# Altium schematic sheet Charger.SchDoc
size A3
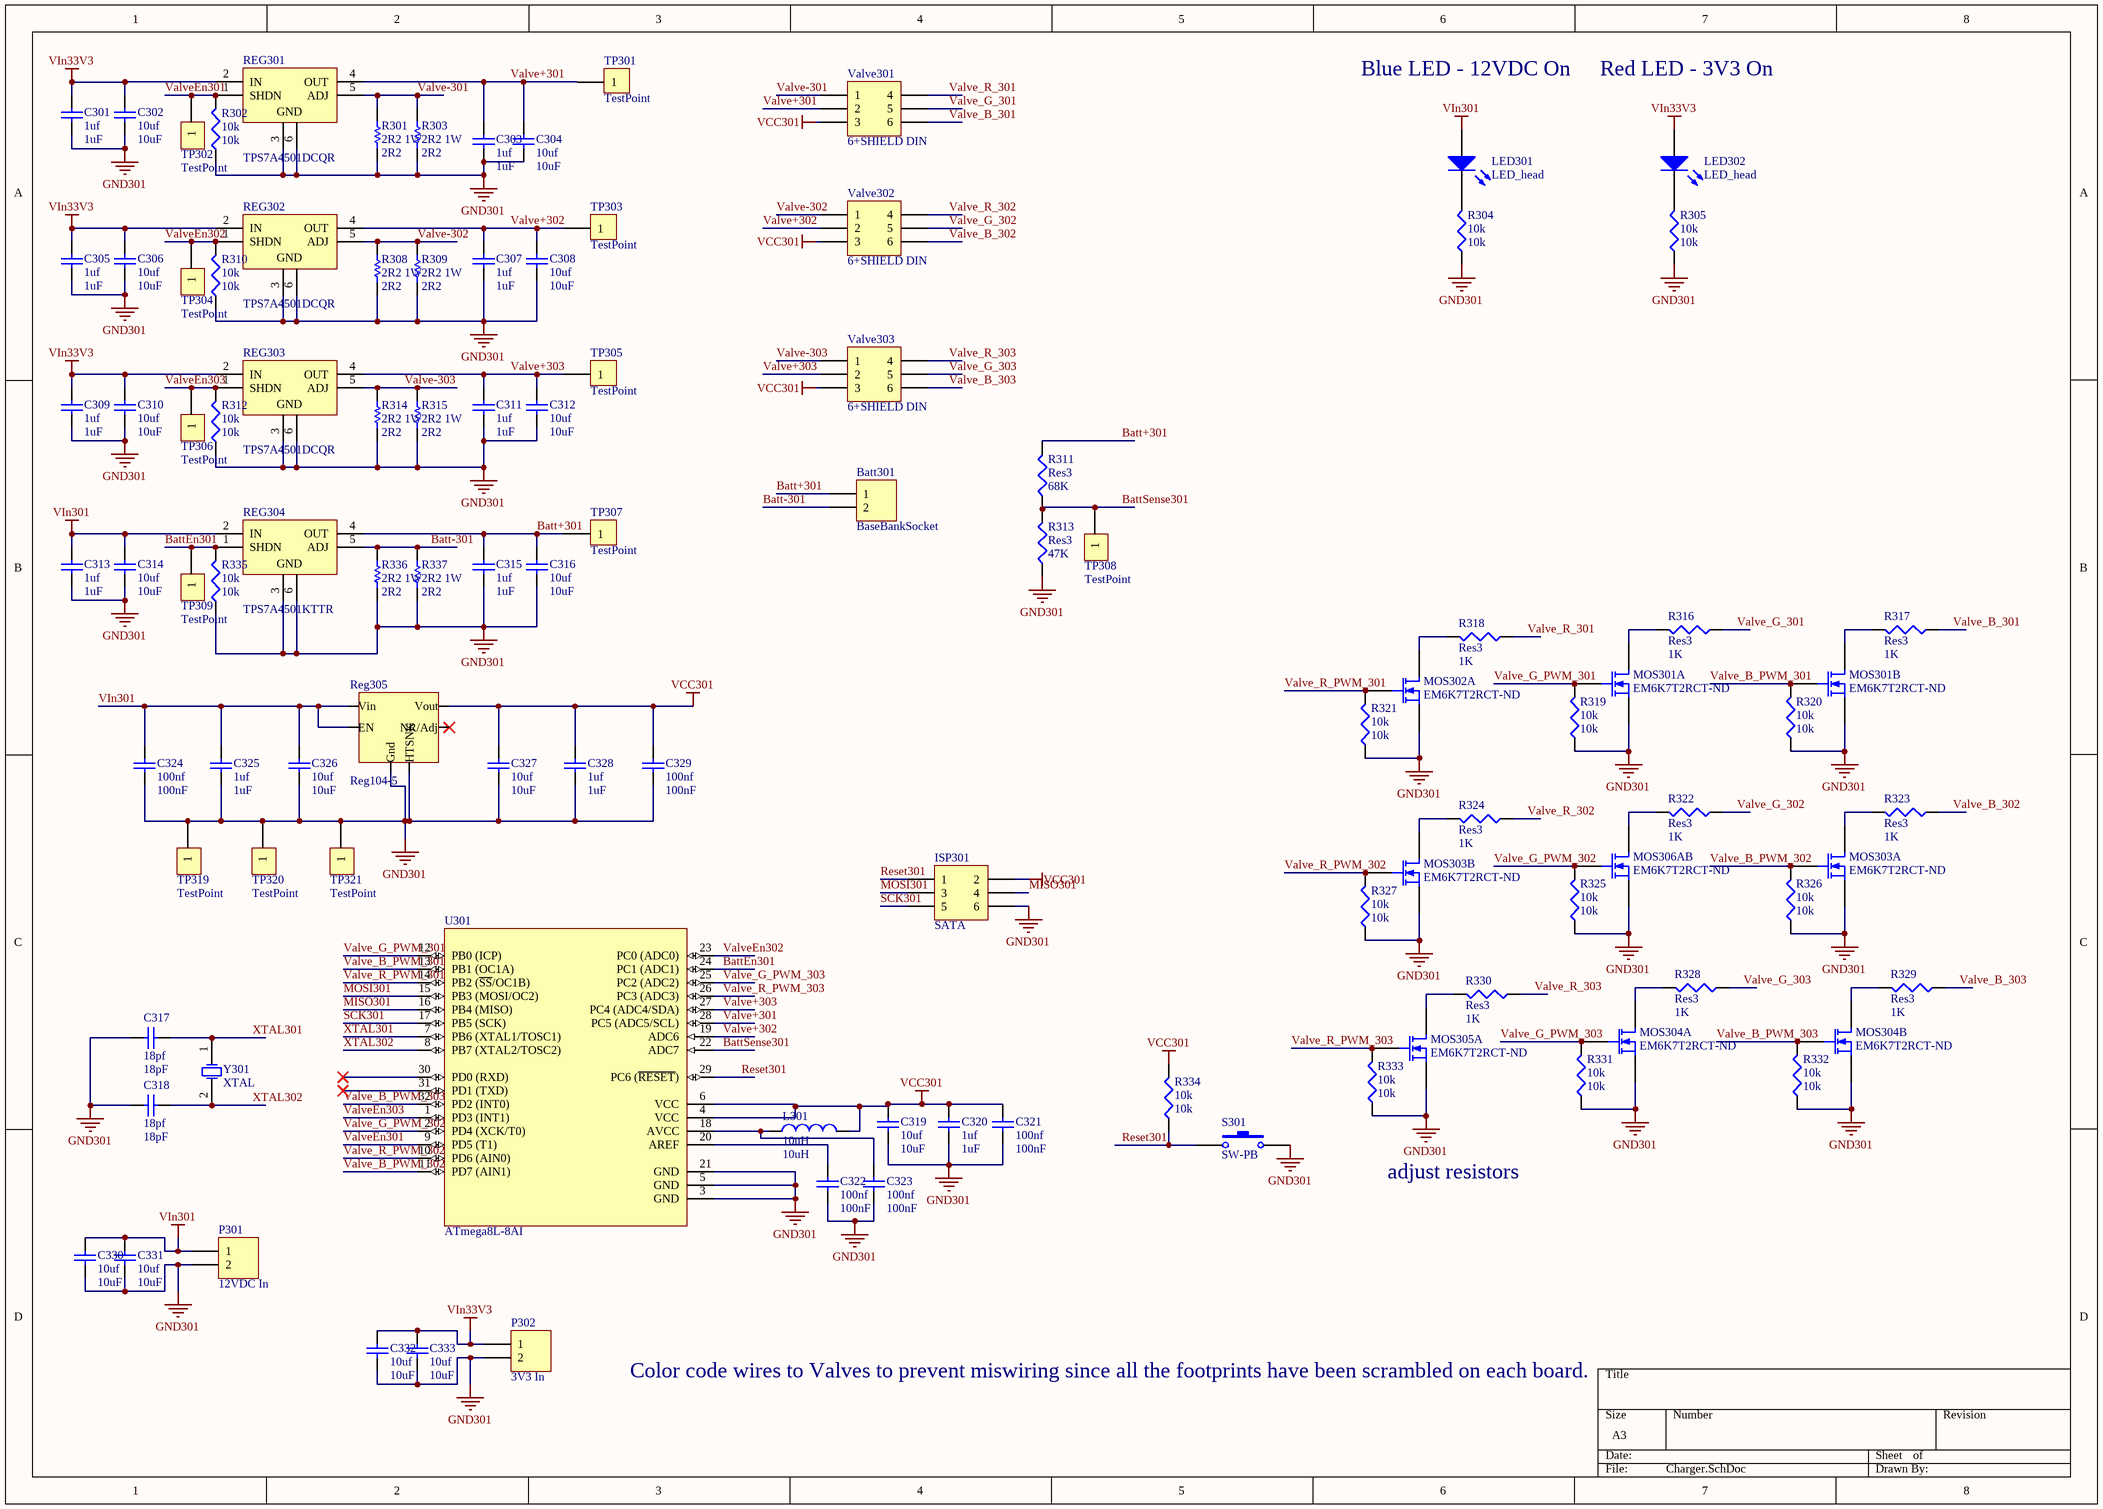
[diagram p0: Charger.SchDoc]

## Parts
Batt301  BaseBankSocket  [HDR1X2H]
C301  1uf  [0603]
C302  10uf  [0805]
C303  1uf  [0603]
C304  10uf  [0805]
C305  1uf  [0603]
C306  10uf  [0805]
C307  1uf  [0603]
C308  10uf  [0805]
C309  1uf  [0603]
C310  10uf  [0805]
C311  1uf  [0603]
C312  10uf  [0805]
C313  1uf  [0603]
C314  10uf  [0805]
C315  1uf  [0603]
C316  10uf  [0805]
C317  18pf  [0603]
C318  18pf  [0603]
C319  10uf  [0805]
C320  1uf  [0603]
C321  100nf  [0603]
C322  100nf  [0603]
C323  100nf  [0603]
C324  100nf  [0603]
C325  1uf  [0603]
C326  10uf  [0805]
C327  10uf  [0805]
C328  1uf  [0603]
C329  100nf  [0603]
C330  10uf  [0805]
C331  10uf  [0805]
C332  10uf  [0805]
C333  10uf  [0805]
ISP301  SATA  [SATA]
L301  10uH  [0805]
LED301  LED_head  [2 pin switch (surface mount)]
LED302  LED_head  [2 pin switch (surface mount)]
MOS301  EM6K7T2RCT-ND  [EM6K7T2R-EMT6]  (parts A,B of 2)
MOS302  EM6K7T2RCT-ND  [EM6K7T2R-EMT6]  (part A of 2)
MOS303  EM6K7T2RCT-ND  [EM6K7T2R-EMT6]  (parts A,B of 2)
MOS304  EM6K7T2RCT-ND  [EM6K7T2R-EMT6]  (parts A,B of 2)
MOS305  EM6K7T2RCT-ND  [EM6K7T2R-EMT6]  (part A of 2)
MOS306A  EM6K7T2RCT-ND  [EM6K7T2R-EMT6]  (part B of 2)
P301  12VDC In  [HDR1X2H]
P302  3V3 In  [HDR1X2H]
R301  2R2 1W  value 2R2  [Resistor 1W]
R302  10k  [0603]
R303  2R2 1W  value 2R2  [Resistor 1W]
R304  10k  [0603]
R305  10k  [0603]
R308  2R2 1W  value 2R2  [Resistor 1W]
R309  2R2 1W  value 2R2  [Resistor 1W]
R310  10k  [0603]
R311  Res3  value 68K  [0805]
R312  10k  [0603]
R313  Res3  value 47K  [0805]
R314  2R2 1W  value 2R2  [Resistor 1W]
R315  2R2 1W  value 2R2  [Resistor 1W]
R316  Res3  value 1K  [0805]
R317  Res3  value 1K  [0805]
R318  Res3  value 1K  [0805]
R319  10k  [0603]
R320  10k  [0603]
R321  10k  [0603]
R322  Res3  value 1K  [0805]
R323  Res3  value 1K  [0805]
R324  Res3  value 1K  [0805]
R325  10k  [0603]
R326  10k  [0603]
R327  10k  [0603]
R328  Res3  value 1K  [0805]
R329  Res3  value 1K  [0805]
R330  Res3  value 1K  [0805]
R331  10k  [0603]
R332  10k  [0603]
R333  10k  [0603]
R334  10k  [0603]
R335  10k  [0603]
R336  2R2 1W  value 2R2  [Resistor 1W]
R337  2R2 1W  value 2R2  [Resistor 1W]
REG301  TPS7A4501DCQR  [TPS7A4501KTTR heatsinked]
REG302  TPS7A4501DCQR  [TPS7A4501KTTR heatsinked]
REG303  TPS7A4501DCQR  [TPS7A4501KTTR heatsinked]
REG304  TPS7A4501KTTR  [TPS7A4501KTTR heatsinked]
Reg305  Reg104-5  [REG104-5-DDPAK5]
S301  SW-PB  [2 pin switch (surface mount)]
TP301  TestPoint  [TestPoint]
TP302  TestPoint  [TestPoint]
TP303  TestPoint  [TestPoint]
TP304  TestPoint  [TestPoint]
TP305  TestPoint  [TestPoint]
TP306  TestPoint  [TestPoint]
TP307  TestPoint  [TestPoint]
TP308  TestPoint  [TestPoint]
TP309  TestPoint  [TestPoint]
TP319  TestPoint  [TestPoint]
TP320  TestPoint  [TestPoint]
TP321  TestPoint  [TestPoint]
U301  ATmega8L-8AI  [ATMega_GOOD]
Valve301  6+SHIELD DIN  [Valve male]
Valve302  6+SHIELD DIN  [Valve male]
Valve303  6+SHIELD DIN  [Valve male]
Y301  XTAL  [ABLS-16MHz-B4-T]

## Nets
GND301: C301.1 C302.1 C303.1 C304.1 C305.1 C306.1 C307.1 C308.1 C309.1 C310.1 C311.1 C312.1 C313.1 C314.1 C315.1 C316.1 C317.1 C318.1 C319.1 C320.1 C321.1 C322.1 C323.1 C324.1 C325.1 C326.1 C327.1 C328.1 C329.1 C330.1 C331.1 C332.1 C333.1 ISP301.6 MOS301.1(S) MOS301.4(S) MOS302.1(S) MOS303.1(S) MOS303.4(S) MOS304.1(S) MOS304.4(S) MOS305.1(S) MOS306A.4(S) P301.2 P302.2 R301.2 R302.1 R303.2 R304.1 R305.1 R308.2 R309.2 R310.1 R312.1 R313.1 R314.1 R315.1 R319.1 R320.1 R321.1 R325.1 R326.1 R327.1 R331.1 R332.1 R333.1 R335.1 R336.1 R337.1 REG301.3(GND) REG301.6(GND) REG302.3(GND) REG302.6(GND) REG303.3(GND) REG303.6(GND) REG304.3(GND) REG304.6(GND) Reg305.3(Gnd) Reg305.6(HTSNK) S301.2 TP319.1 TP320.1 TP321.1 U301.3(GND) U301.5(GND) U301.21(GND)
VCC301: C319.2 C320.2 C321.2 C327.2 C328.2 C329.2 ISP301.2 L301.2 R334.2 Reg305.2(Vout) U301.4(VCC) U301.6(VCC) Valve301.3 Valve302.3 Valve303.3
VIn33V3: C301.2 C302.2 C305.2 C306.2 C309.2 C310.2 C332.2 C333.2 LED302.1(A) P302.1 REG301.2(IN) REG302.2(IN) REG303.2(IN)
VIn301: C313.2 C314.2 C324.2 C325.2 C326.2 C330.2 C331.2 LED301.1(A) P301.1 REG304.2(IN) Reg305.1(Vin) Reg305.5(EN)
Batt+301: Batt301.1 C315.2 C316.2 R311.2 REG304.4(OUT) TP307.1
Batt-301: Batt301.2 R336.2 R337.2 REG304.5(ADJ)
BattEn301: R335.2 REG304.1(SHDN) TP309.1 U301.24(PC1_(ADC1))
BattSense301: R311.1 R313.2 TP308.1 U301.22(ADC7)
MISO301: ISP301.4 U301.16(PB4_(MISO))
MOSI301: ISP301.3 U301.15(PB3_(MOSI/OC2))
Reset301: ISP301.1 R334.1 S301.1 U301.29(PC6_(~{RESET}))
SCK301: ISP301.5 U301.17(PB5_(SCK))
Valve+301: C303.2 C304.2 REG301.4(OUT) TP301.1 U301.28(PC5_(ADC5/SCL)) Valve301.2
Valve+302: C307.2 C308.2 REG302.4(OUT) TP303.1 U301.19(ADC6) Valve302.2
Valve+303: C311.2 C312.2 REG303.4(OUT) TP305.1 U301.27(PC4_(ADC4/SDA)) Valve303.2
Valve-301: R301.1 R303.1 REG301.5(ADJ) Valve301.1
Valve-302: R308.1 R309.1 REG302.5(ADJ) Valve302.1
Valve-303: R314.2 R315.2 REG303.5(ADJ) Valve303.1
Valve_B_301: R317.1 Valve301.6
Valve_B_302: R323.1 Valve302.6
Valve_B_303: R329.1 Valve303.6
Valve_B_PWM_301: MOS301.5(G) R320.2 U301.13(PB1_(OC1A))
Valve_B_PWM_302: MOS303.2(G) R326.2 U301.11(PD7_(AIN1))
Valve_B_PWM_303: MOS304.5(G) R332.2 U301.32(PD2_(INT0))
Valve_G_301: R316.1 Valve301.5
Valve_G_302: R322.1 Valve302.5
Valve_G_303: R328.1 Valve303.5
Valve_G_PWM_301: MOS301.2(G) R319.2 U301.12(PB0_(ICP))
Valve_G_PWM_302: MOS306A.5(G) R325.2 U301.2(PD4_(XCK/T0))
Valve_G_PWM_303: MOS304.2(G) R331.2 U301.25(PC2_(ADC2))
Valve_R_301: R318.1 Valve301.4
Valve_R_302: R324.1 Valve302.4
Valve_R_303: R330.1 Valve303.4
Valve_R_PWM_301: MOS302.2(G) R321.2 U301.14(PB2_(~{SS}/OC1B))
Valve_R_PWM_302: MOS303.5(G) R327.2 U301.10(PD6_(AIN0))
Valve_R_PWM_303: MOS305.2(G) R333.2 U301.26(PC3_(ADC3))
ValveEn301: R302.2 REG301.1(SHDN) TP302.1 U301.9(PD5_(T1))
ValveEn302: R310.2 REG302.1(SHDN) TP304.1 U301.23(PC0_(ADC0))
ValveEn303: R312.2 REG303.1(SHDN) TP306.1 U301.1(PD3_(INT1))
XTAL301: C317.2 U301.7(PB6_(XTAL1/TOSC1)) Y301.1(OSC1)
XTAL302: C318.2 U301.8(PB7_(XTAL2/TOSC2)) Y301.2(OSC2)
NetC322_2: C322.2 U301.20(AREF)
NetC323_2: C323.2 L301.1 U301.18(AVCC)
NetLED301_2: LED301.2(K) R304.2
NetLED302_2: LED302.2(K) R305.2
NetMOS301_3: MOS301.3(D) R317.2
NetMOS301_6: MOS301.6(D) R316.2
NetMOS302_6: MOS302.6(D) R318.2
NetMOS303_3: MOS303.3(D) R324.2
NetMOS303_6: MOS303.6(D) R323.2
NetMOS304_3: MOS304.3(D) R329.2
NetMOS304_6: MOS304.6(D) R328.2
NetMOS305_6: MOS305.6(D) R330.2
NetMOS306A_3: MOS306A.3(D) R322.2

Not connected (* = marked no-connect by the designer): Reg305 4(NR/Adj)*; U301 30(PD0_(RXD))* 31(PD1_(TXD))*

## Notes on the sheet
- Blue LED - 12VDC On
- Red LED - 3V3 On
- adjust resistors
- Color code wires to Valves to prevent miswiring since all the footprints have been scrambled on each board.

## Library data of the parts
Batt301 = Header 2: Header, 2-Pin; LatestRevisionDate: 17-Jul-2002; LatestRevisionNote: Re-released for DXP Platform.; Publisher: Altium Limited
C301-C333 = Cap Semi: Capacitor (Semiconductor SIM Model); Published: 8-Jun-2000; LatestRevisionDate: 29-May-2009; LatestRevisionNote: IPC-7351 Footprint Added.; PackageReference: C1206; Publisher: Altium Limited; PackageDescription: Chip Capacitor
  C301 C303 C305 C307 C309 C311 C313 C315 C320 C325 C328: Value: 1uF
  C302 C304 C306 C308 C310 C312 C314 C316 C319 C326 C327 C330-C333: Value: 10uF
  C317 C318: Value: 18pF
  C321-C324 C329: Value: 100nF
ISP301 = Header 3X2: Header, 3-Pin, Dual row; LatestRevisionDate: 17-Jul-2002; LatestRevisionNote: Re-released for DXP Platform.; Publisher: Altium Limited
L301 = Inductor: Code_IEC: 1005; Published: 8-Jun-2000; LatestRevisionDate: 29-May-2009; LatestRevisionNote: IPC-7351 Footprint Added.; PackageReference: 0402-A; Publisher: Altium Limited; PackageDescription: Chip Inductor; Code_JEITA: 0402; Value: 10uH
LED301 LED302 = LED0: Typical INFRARED GaAs LED; Published: 8-Jun-2000; LatestRevisionDate: 08-Jul-2005; LatestRevisionNote: Mech Layer 1 removed.; PackageReference: LED-0; Publisher: Altium Limited
P301 P302 = Header 2H: Header, 2-Pin, Right Angle; LatestRevisionDate: 17-Jul-2002; LatestRevisionNote: Re-released for DXP Platform.; Publisher: Altium Limited
R301 R303 R308 R309 R314 R315 R336 R337 = Res1: Resistor; Published: 8-Jun-2000; LatestRevisionDate: 17-Jul-2002; LatestRevisionNote: Re-released for DXP Platform.; PackageReference: AXIAL-0.3; Publisher: Altium Limited
R302 R304 R305 R310-R313 R316-R335 = Res3: Resistor; Published: 8-Jun-2000; LatestRevisionDate: 29-May-2009; LatestRevisionNote: IPC-7351 Footprint Added.; PackageReference: J1-0603; Publisher: Altium Limited; PackageDescription: Chip Resistor
  R302 R304 R305 R310 R312 R319-R321 R325-R327 R331-R335: Value: 10k
REG301-REG303 = TPS7A4515
REG304 = TPS7A4501
S301 = SW-PB: Switch; Published: 24-Mar-1999; LatestRevisionDate: 17-Jul-2002; LatestRevisionNote: Re-released for DXP Platform.; PackageReference: SPST-2; Publisher: Altium Limited
U301 = ATmega8L-8AI: 8-Bit AVR Microcontroller with 8K Bytes of In-System Programmable Flash Memory; Published: 17-Sep-2003; LatestRevisionDate: 13-Apr-2006; LatestRevisionNote: IPC-7351 Footprint Added.; DatasheetVersion: 2486H-AVR-09/02; PackageVersion: revB, Oct-2001; PackageReference: 32A; Publisher: Altium Limited; PackageDescription: 32-Pin Thin Quad Flat Pack 0.8 mm Pitch; Code_JEDEC: MS-026-ABA; ComponentLink1Description: Manufacturer Link; ComponentLink1URL: http://www.atmel.com; ComponentLink2Description: Datasheet; ComponentLink2URL: http://www.atmel.com/dyn/resources/prod_documents/doc2486.pdf
Valve301-Valve303 = Header 3X2A: Header, 3-Pin, Dual row; LatestRevisionDate: 17-Jul-2002; LatestRevisionNote: Re-released for DXP Platform.; Publisher: Altium Limited
Y301 = XTAL: Crystal Oscillator; Published: 8-Jun-2000; LatestRevisionDate: 17-Jul-2002; LatestRevisionNote: Re-released for DXP Platform.; PackageReference: R38; Publisher: Altium Limited
MOS301-MOS305 MOS306A = EM6K7T2RCT-ND: Supplier 1: Digi-Key